# EAGLE design pro_mini_a7105_shield_working (EAGLE 6.5.0)
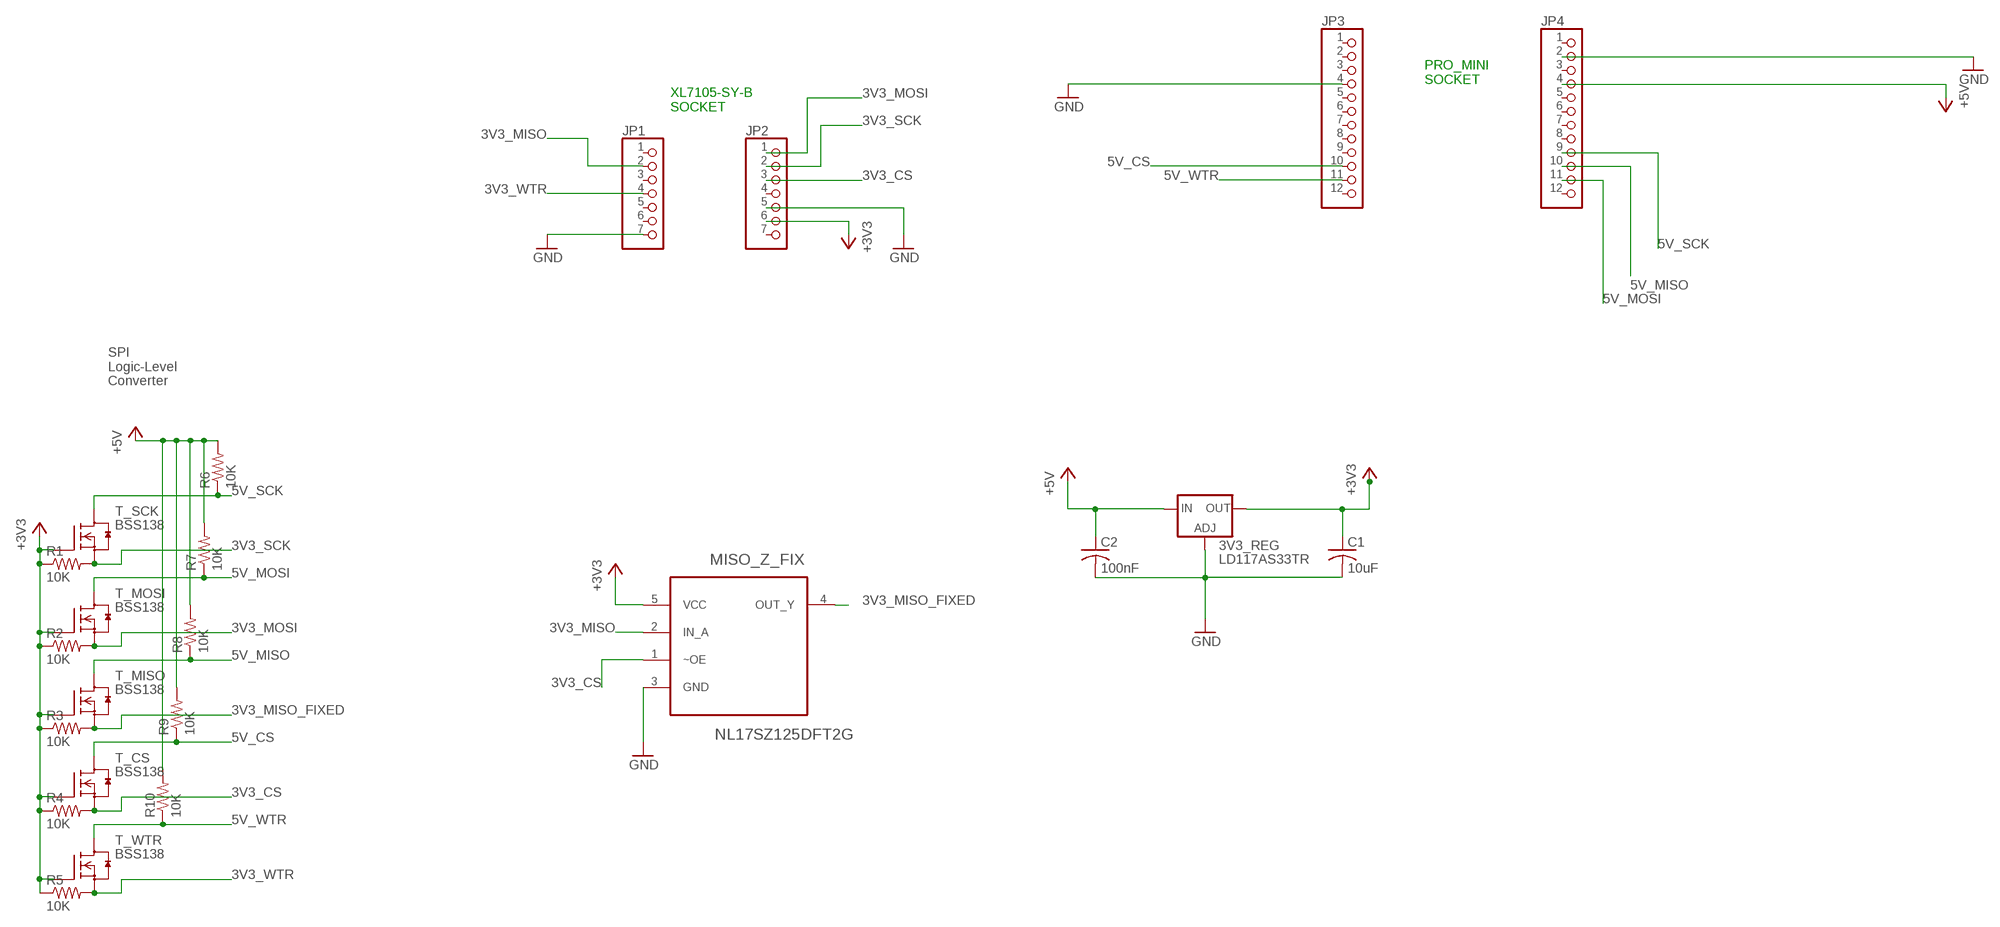
[diagram p0: schematic, sheet 1]

## Parts
3V3_REG  LD117AS33TR  [SOT223]
C1  10uF  C-USC0805  [C0805]
C2  100nF  C-USC0805  [C0805]
JP1  PINHD-1X7M  [1X07M]
JP2  PINHD-1X7M  [1X07M]
JP3  PINHD-1X12  [1X12]
JP4  PINHD-1X12  [1X12]
MISO_Z_FIX  NL17SZ125DFT2G  [SOT65P210X110-5N]
R1  10K  R-US_R0805  [R0805]
R2  10K  R-US_R0805  [R0805]
R3  10K  R-US_R0805  [R0805]
R4  10K  R-US_R0805  [R0805]
R5  10K  R-US_R0805  [R0805]
R6  10K  R-US_R0805  [R0805]
R7  10K  R-US_R0805  [R0805]
R8  10K  R-US_R0805  [R0805]
R9  10K  R-US_R0805  [R0805]
R10  10K  R-US_R0805  [R0805]
T_CS  BSS138  [SOT23]
T_MISO  BSS138  [SOT23]
T_MOSI  BSS138  [SOT23]
T_SCK  BSS138  [SOT23]
T_WTR  BSS138  [SOT23]

## Nets
3V3_CS: JP2.3 MISO_Z_FIX.1(~OE) R4.2 T_CS.2(S)
3V3_MISO: JP1.2 MISO_Z_FIX.2(IN_A)
3V3_MISO_FIXED: MISO_Z_FIX.4(OUT_Y) R3.2 T_MISO.2(S)
3V3_MOSI: JP2.1 R2.2 T_MOSI.2(S)
3V3_SCK: JP2.2 R1.2 T_SCK.2(S)
3V3_WTR: JP1.4 R5.2 T_WTR.2(S)
5V_CS: JP3.10 R9.1 T_CS.3(D)
5V_MISO: JP4.10 R8.1 T_MISO.3(D)
5V_MOSI: JP4.11 R7.1 T_MOSI.3(D)
5V_SCK: JP4.9 R6.1 T_SCK.3(D)
5V_WTR: JP3.11 R10.1 T_WTR.3(D)
+3V3: 3V3_REG.4(OUT) C1.1 JP2.6 MISO_Z_FIX.5(VCC) R1.1 R2.1 R3.1 R4.1 R5.1 T_CS.1(G) T_MISO.1(G) T_MOSI.1(G) T_SCK.1(G) T_WTR.1(G)
+5V: 3V3_REG.3(IN) C2.1 JP4.4 R6.2 R7.2 R8.2 R9.2 R10.2
GND: 3V3_REG.1(ADJ) C1.2 C2.2 JP1.7 JP2.5 JP3.4 JP4.2 MISO_Z_FIX.3(GND)
Unconnected: JP1.1 JP1.3 JP1.5 JP1.6 JP2.4 JP2.7 JP3.1 JP3.2 JP3.3 JP3.5 JP3.6 JP3.7 JP3.8 JP3.9 JP3.12 JP4.1 JP4.3 JP4.5 JP4.6 JP4.7 JP4.8 JP4.12

## Notes on the sheet
- PRO_MINI
  SOCKET
- XL7105-SY-B
  SOCKET
- SPI
  Logic-Level
  Converter

## Library data of the parts
3V3_REG = v-reg:LD117A?*: Low drop fixed and adjustable positive voltage regulators 1 A Source: http://www.st.com/stonline/products/literature/ds/7194/ld1117axx.pdf
C1 C2 = rcl:C-US: CAPACITOR, American symbol
JP1 JP2 = bob_starr_pinhead:PINHD-1X7: PIN HEADER
JP3 JP4 = bob_starr_pinhead:PINHD-1X12: PIN HEADER
MISO_Z_FIX = ON Semiconductor_By_element14_Batch_1:NL17SZ125DFT2G: Non-Inverting 3-State Buffer; MPN: NL17SZ125DFT2G; OC_FARNELL: 1468775; OC_NEWARK: 83H7736; PACKAGE: SC70-5; SUPPLIER: ON SEMICONDUCTOR
R1-R10 = resistor:R-US_: RESISTOR, American symbol
T_CS T_MISO T_MOSI T_SCK T_WTR = m-pad-2.1:BSS138: Fairchild Semiconductors BSS138 N-Channel Logic Level Enhancement Mode Field Effect Transistor General Description: These N-Channel enhancement mode field effect transistors are produced using Fairchild's proprietary, high cell density, DMOS technology. These products have been designed to minimize on-state resistance while provide rugged, reliable, and fast switching performance.These products are particularly suited for low voltage, low current applications such as small servo motor control, power MOSFET gate drivers, and other switching applications. Features: 0.22 A, 50 V. RDS(ON) = 3.5Ohm @ VGS = 10 V RDS(ON) = 6.0Ohm @ VGS = 4.5 V High density cell design for extremely low RDS(ON) Rugged and Reliable Compact industry standard SOT-23 surface mount package Please send any comments to: messi@users.sourceforge.net

## Board
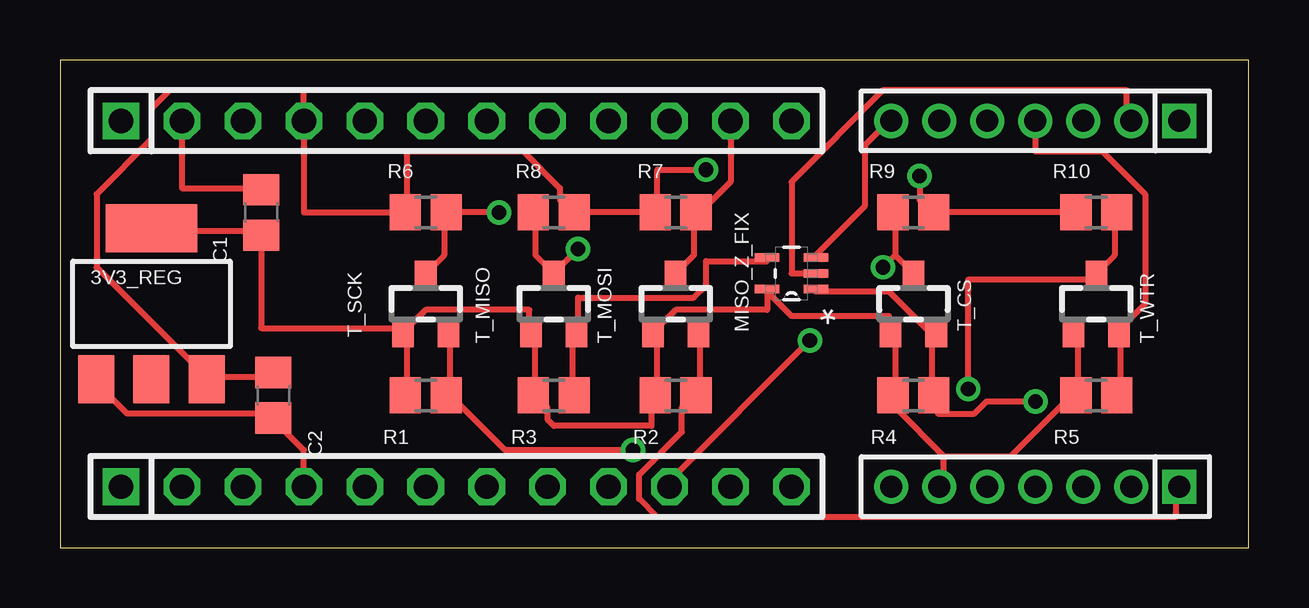
[diagram p1: board, top side]
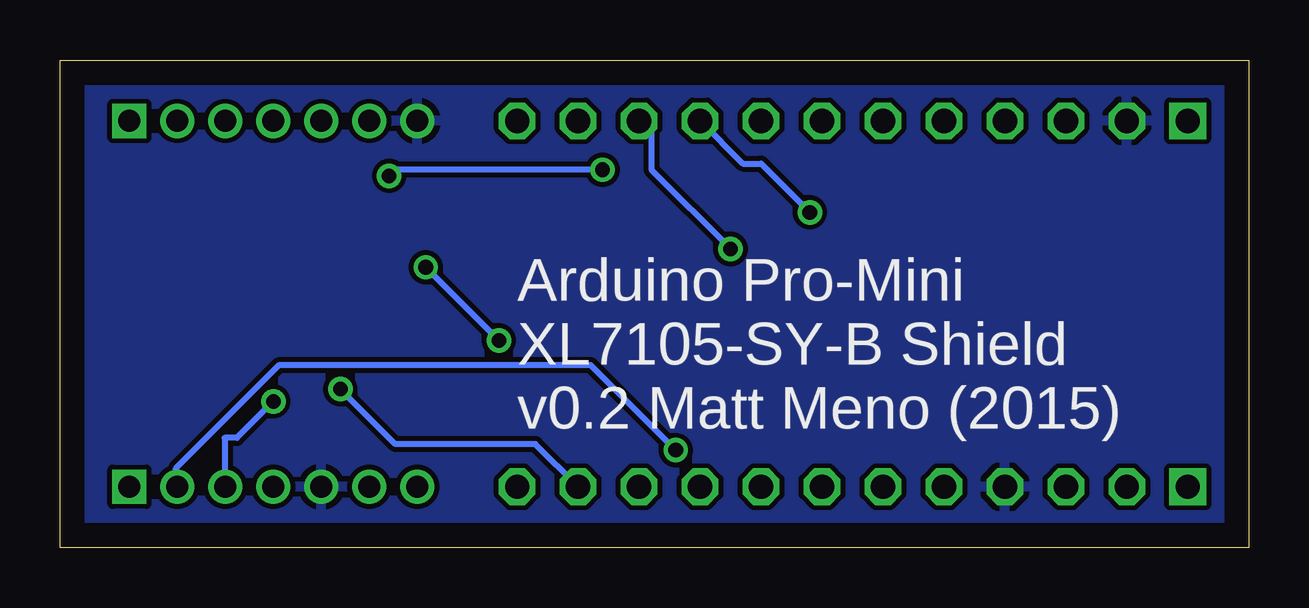
[diagram p2: board, bottom side, seen from below]

Size 49.53 x 20.32 mm. Coordinates in mm from the lower left corner, seen from the top.
Outline: 0,0 49.53,0 49.53,20.32 0,20.32 0,0
Copper layers (1*16): Top 0.035mm / dielectric 1.5mm / Bottom 0.035mm
Design rules "default": minimum track width 10mil, minimum drill 24mil, track to track 8mil, track to pad 8mil, pad to pad 8mil, via to via 8mil, smd to smd 8mil, copper to edge 40mil, drill to drill 8mil, minimum pad ring 10mil, minimum via ring 8mil, stop-mask expansion 4mil, vias tented up to drill 0mil, thermal gap 10mil

### Footprints (pad centres in the part's own frame; a part is rotated, then mirrored left to right if it is on the bottom)
SOT223 = smd 1.5 x 2: 1 -2.3,-3.15; 2 0,-3.15; 3 2.3,-3.15 | smd 3.8 x 2: 4 0,3.15
C0805 = smd 1.3 x 1.5: 1 -0.95,0; 2 0.95,0
1X07M = drill 0.914 square: 1 -6,0 | drill 0.914: 2 -4,0; 3 -2,0; 4 0,0; 5 2,0; 6 4,0; 7 6,0
1X12 = drill 1.016 square: 1 -13.97,0 | drill 1.016 octagon: 2 -11.43,0; 3 -8.89,0; 4 -6.35,0; 5 -3.81,0; 6 -1.27,0; 7 1.27,0; 8 3.81,0; 9 6.35,0; 10 8.89,0; 11 11.43,0; 12 13.97,0
SOT65P210X110-5N = smd 1.016 x 0.356: 1 -1.016,0.66; 2 -1.016,0; 3 -1.016,-0.66; 4 1.016,-0.66; 5 1.016,0.66
R0805 = smd 1.3 x 1.5: 1 -0.85,0; 2 0.85,0
SOT23 = smd 0.9 x 1.2: 1 -0.95,-1.2; 2 0.95,-1.2; 3 0,1.2

### Placement (x,y rotation side)
3V3_REG  3.81,10.16 0 top
C1  8.38,13.97 90 top
C2  8.89,6.35 270 top
JP1  40.64,17.78 180 top
JP2  40.64,2.54 180 top
JP3  16.51,2.54 0 top
JP4  16.51,17.78 0 top
MISO_Z_FIX  30.48,11.43 180 top
R1  15.24,6.35 0 top
R2  25.65,6.35 0 top
R3  20.57,6.35 0 top
R4  35.56,6.35 0 top
R5  43.18,6.35 0 top
R6  15.24,13.97 180 top
R7  25.65,13.97 180 top
R8  20.57,13.97 0 top
R9  35.56,13.97 0 top
R10  43.18,13.97 180 top
T_CS  35.56,10.16 0 top
T_MISO  20.57,10.16 0 top
T_MOSI  25.65,10.16 0 top
T_SCK  15.24,10.16 0 top
T_WTR  43.18,10.16 0 top

### Tracks (layer width: path | path; a pad name or v marks a point on that pad's centre or on a via)
3V3_CS  (via drill 0.61)
  Top 0.254: 36.32,8.89 34.54,10.67 31.5,10.67 MISO_Z_FIX.1 | 36.32,8.89 36.32,6.35 R4.2 36.58,6.35 36.58,5.59 38.1,5.59 38.61,6.1 v40.64,6.1 | 36.32,8.89 T_CS.2
  Bottom 0.254: v40.64,6.1 42.16,4.57 42.67,4.57 42.67,2.54 JP2.3
3V3_MISO
  Top 0.254: MISO_Z_FIX.2 30.48,11.43 30.48,15.24 34.29,19.05 44.45,19.05 44.45,17.78 JP1.2
3V3_MISO_FIXED
  Top 0.254: MISO_Z_FIX.4 29.46,11.94 26.92,11.94 26.92,10.92 26.42,10.41 21.59,10.41 21.59,9.14 T_MISO.2 21.34,8.89 21.34,6.35 R3.2
3V3_MOSI
  Top 0.254: T_MOSI.2 26.67,8.89 26.67,6.35 R2.2 26.42,6.35 25.91,5.84 25.91,4.83 24.13,3.05 24.13,2.03 24.89,1.27 46.48,1.27 46.48,2.54 JP2.1
3V3_SCK  (via drill 0.61)
  Top 0.254: 16.26,6.35 16.26,8.89 T_SCK.2 | 16.26,6.35 18.54,4.06 v23.88,4.06 | 16.26,6.35 R1.2
  Bottom 0.254: v23.88,4.06 27.43,7.62 40.39,7.62 44.7,3.3 44.7,2.54 JP2.2
3V3_WTR
  Top 0.254: R5.2 44.2,6.35 44.2,8.89 T_WTR.2 44.2,9.14 45.21,10.16 45.21,14.73 43.43,16.51 40.64,16.51 JP1.4
5V_CS  (via drill 0.61)
  Top 0.254: 34.8,12.19 35.56,11.43 T_CS.3 | 34.8,12.19 34.8,13.97 R9.1 | v34.29,11.68 34.8,12.19 | v31.24,8.64 25.4,2.79 JP3.10
  Bottom 0.254: v31.24,8.64 v34.29,11.68
5V_MISO  (via drill 0.61)
  Top 0.254: 20.57,11.43 19.81,12.19 19.81,13.97 R8.1 | v21.59,12.45 20.57,11.43 | 20.57,11.43 T_MISO.3
  Bottom 0.254: v21.59,12.45 24.89,15.75 24.89,17.78 JP4.10
5V_MOSI
  Top 0.254: T_MOSI.3 25.65,11.43 26.42,12.19 26.42,13.97 R7.1 26.67,13.97 27.94,15.24 JP4.11
5V_SCK  (via drill 0.61)
  Top 0.254: T_SCK.3 15.24,11.43 16,12.19 16,13.97 R6.1 v18.29,13.97
  Bottom 0.254: v18.29,13.97 20.32,16 21.08,16 JP4.9
5V_WTR  (via drill 0.61)
  Top 0.254: R10.1 43.94,13.97 43.94,12.19 43.18,11.43 T_WTR.3 43.18,11.18 37.85,11.18 v37.85,6.6
  Bottom 0.254: v37.85,6.6 35.56,4.32 29.72,4.32 JP3.11
+3V3
  Top 0.254: T_SCK.1 14.48,8.89 14.48,6.35 R1.1 | 19.81,6.35 19.81,8.89 T_MISO.1 19.56,9.14 19.56,9.91 15.24,9.91 14.48,9.14 T_SCK.1 | 3V3_REG.4 3.81,13.21 8.38,13.21 C1.1 8.38,9.14 14.22,9.14 T_SCK.1 | T_WTR.1 42.42,8.89 42.42,6.35 R5.1 42.16,6.35 39.62,3.81 36.83,3.81 | 36.83,3.81 36.83,2.54 JP2.6 | 29.46,10.67 30.48,9.65 34.54,9.65 34.54,9.14 T_CS.1 34.8,8.89 34.8,6.35 | 29.46,10.67 29.46,9.91 25.65,9.91 24.89,9.14 T_MOSI.1 24.89,8.89 24.89,6.35 R2.1 24.64,6.35 24.64,5.08 20.57,5.08 20.32,5.33 20.32,5.84 19.81,6.35 | 29.46,10.67 MISO_Z_FIX.5 | 36.83,3.81 34.8,5.84 34.8,6.35 | 34.8,6.35 R4.1 | 19.81,6.35 R3.1
+5V  (via drill 0.61)
  Top 0.254: R10.2 R9.2 36.32,13.97 35.81,14.48 v35.81,15.49 | C2.1 8.89,7.11 6.35,7.11 3V3_REG.3 6.1,7.11 1.52,11.68 1.52,14.73 3.81,17.02 3.81,18.29 4.57,19.05 10.16,19.05 JP4.4 10.16,13.97 R6.2 14.48,13.97 14.48,16.51 19.3,16.51 20.83,14.99 20.83,14.48 21.34,13.97 R8.2 R7.2 24.89,13.97 24.89,15.75 v26.92,15.75
  Bottom 0.254: v35.81,15.49 35.56,15.75 v26.92,15.75
GND
  Top 0.254: MISO_Z_FIX.3 31.5,12.19 33.53,14.22 33.53,16.76 34.54,17.78 JP1.7 | JP3.4 10.16,4.06 8.89,5.33 C2.2 8.89,5.59 2.79,5.59 1.52,6.86 3V3_REG.1 | JP4.2 5.08,14.99 8.38,14.99 C1.2
  pour Bottom: -4.06,20.07 -4.06,-1.78 51.56,-1.78 51.56,23.37 -4.06,23.37 -4.06,21.08

### Text on the board
bNames: Arduino Pro-Mini / XL7105-SY-B Shield / v0.2 Matt Meno (2015)